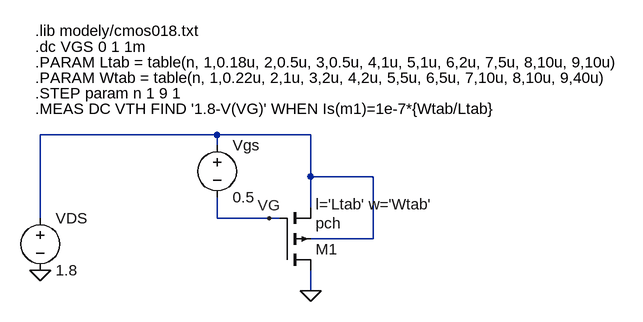
[diagram p0: schematic P21-mos.asc]
P21-mos.asc, the LTspice schematic file:
Version 4.1
SHEET 1 992 680
WIRE 80 64 -192 64
WIRE 224 64 80 64
WIRE 80 80 80 64
WIRE 224 128 224 64
WIRE 320 128 224 128
WIRE 224 176 224 128
WIRE -192 192 -192 64
WIRE 80 192 80 160
WIRE 160 192 80 192
WIRE 176 192 160 192
WIRE 320 224 320 128
WIRE 320 224 224 224
WIRE 224 304 224 272
FLAG 224 304 0
FLAG -192 272 0
FLAG 160 192 VG
SYMBOL voltage 80 64 R0
WINDOW 123 0 0 Left 0
WINDOW 39 0 0 Left 0
SYMATTR InstName Vgs
SYMATTR Value 0.5
SYMBOL voltage -192 176 R0
WINDOW 123 0 0 Left 0
WINDOW 39 0 0 Left 0
SYMATTR InstName VDS
SYMATTR Value 1.8
SYMBOL pmos4 176 272 M180
WINDOW 123 56 101 Left 2
SYMATTR InstName M1
SYMATTR Value pch
SYMATTR Value2 l='Ltab' w='Wtab'
TEXT -200 -96 Left 2 !.lib modely/cmos018.txt
TEXT -200 -24 Left 2 !.PARAM Wtab = table(n, 1,0.22u, 2,1u, 3,2u, 4,2u, 5,5u, 6,5u, 7,10u, 8,10u, 9,40u)
TEXT -200 -48 Left 2 !.PARAM Ltab = table(n, 1,0.18u, 2,0.5u, 3,0.5u, 4,1u, 5,1u, 6,2u, 7,5u, 8,10u, 9,10u)
TEXT -200 -72 Left 2 !.dc VGS 0 1 1m
TEXT -200 0 Left 2 !.STEP param n 1 9 1
TEXT -200 24 Left 2 !.MEAS DC VTH FIND '1.8-V(VG)' WHEN Is(m1)=1e-7*{Wtab/Ltab}

The netlist it stands for:
* P21-mos.asc
Vgs N001 VG 0.5
VDS N001 0 1.8
M1 0 VG N001 N001 pch l='Ltab' w='Wtab'
.model NMOS NMOS
.model PMOS PMOS
.lib standard.mos
.lib modely/cmos018.txt
.PARAM Wtab = table(n, 1,0.22u, 2,1u, 3,2u, 4,2u, 5,5u, 6,5u, 7,10u, 8,10u, 9,40u)
.PARAM Ltab = table(n, 1,0.18u, 2,0.5u, 3,0.5u, 4,1u, 5,1u, 6,2u, 7,5u, 8,10u, 9,10u)
.dc VGS 0 1 1m
.STEP param n 1 9 1
.MEAS DC VTH FIND '1.8-V(VG)' WHEN Is(m1)=1e-7*{Wtab/Ltab}
.backanno
.end